# Altium schematic sheet Sheet2.SchDoc
size B; SheetNumber: 1; SheetTotal: 1; SPICEModelCacheWPHGAQRQ: <root> / <DocumentId>WPHGAQRQ</DocumentId> / <CacheFrame Number="0"> / <Model Name="diode" Kind="MDL"> / <Text>*Default Diode / *Diode Pinout: A,K / .MODEL DIODE D()</Text> / </Model> / </CacheFrame> / </root>
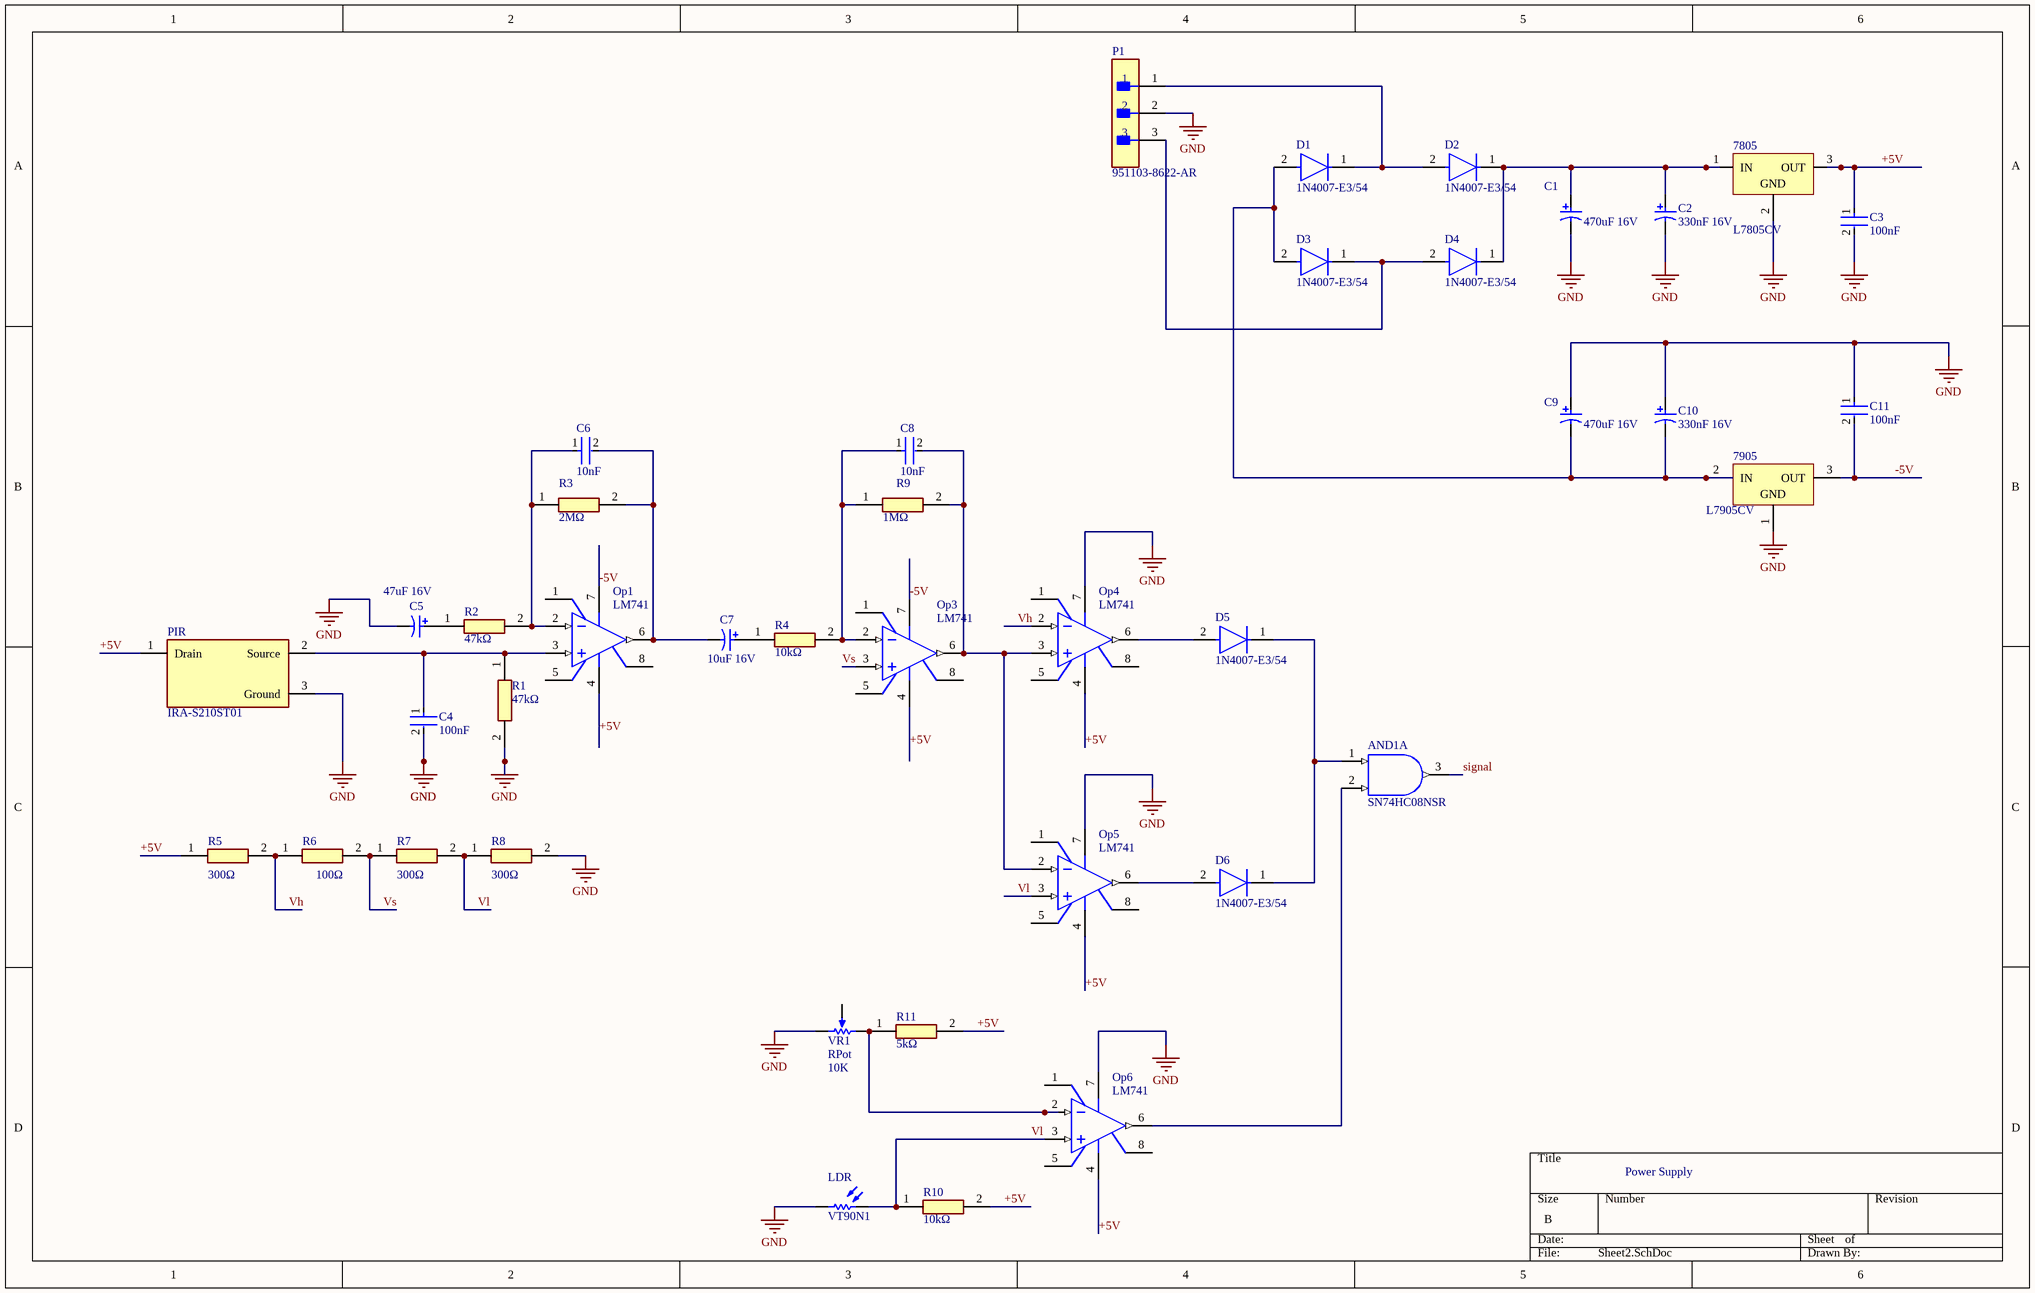
[diagram p0: Sheet2.SchDoc]

## Parts
7805  L7805CV  [TO220]
7905  L7905CV  [TO-220]
AND1  SN74HC08NSR  [NS0014A_M]  (part A of 5)
C1  470uF 16V  [CAPPR65-350-1150X800X1250]
C2  330nF 16V  [CAPPR65-350-1150X800X1250]
C3  100nF  [FP-K15H5-MFG]
C4  100nF  [FP-K15H5-MFG]
C5  47uF 16V  [CAPPR65-350-1150X800X1250]
C6  10nF  [FP-K15H5-MFG]
C7  10uF 16V  [CAPPR65-350-1150X800X1250]
C8  10nF  [FP-K15H5-MFG]
C9  470uF 16V  [CAPPR65-350-1150X800X1250]
C10  330nF 16V  [CAPPR65-350-1150X800X1250]
C11  100nF  [FP-K15H5-MFG]
D1  1N4007-E3/54  [FP-1N4007-MFG]
D2  1N4007-E3/54  [FP-1N4007-MFG]
D3  1N4007-E3/54  [FP-1N4007-MFG]
D4  1N4007-E3/54  [FP-1N4007-MFG]
D5  1N4007-E3/54  [FP-1N4007-MFG]
D6  1N4007-E3/54  [FP-1N4007-MFG]
LDR  VT90N1  [EXCE-VT90N1]
Op1  LM741  [P0008A]
Op3  LM741  [P0008A]
Op4  LM741  [P0008A]
Op5  LM741  [P0008A]
Op6  LM741  [P0008A]
P1  951103-8622-AR  [FP-951103-8622-AR-MFG]
PIR  IRA-S210ST01  [FP-IRA-S210ST01-MFG]
R1  47kΩ  [RESAD1650W60L650D250]
R2  47kΩ  [RESAD1650W60L650D250]
R3  2MΩ  [RESAD1650W60L650D250]
R4  10kΩ  [RESAD1650W60L650D250]
R5  300Ω  [RESAD1650W60L650D250]
R6  100Ω  [RESAD1650W60L650D250]
R7  300Ω  [RESAD1650W60L650D250]
R8  300Ω  [RESAD1650W60L650D250]
R9  1MΩ  [RESAD1650W60L650D250]
R10  10kΩ  [RESAD1650W60L650D250]
R11  5kΩ  [RESAD1650W60L650D250]
VR1  RPot  value 10K  [VR5]

## Nets
GND: 7805.2(GND) 7905.1(GND) C1.2 C2.2 C3.2 C4.2 C5.2 C9.1 C10.1 C11.1 LDR.1 Op4.7(V+) Op5.7(V+) Op6.7(V+) P1.2 PIR.3(Ground) R1.2 R8.2 VR1.2(BOT)
+5V: 7805.3(OUT) C3.1 Op1.4(V-) Op3.4(V-) Op4.4(V-) Op5.4(V-) Op6.4(V-) PIR.1(Drain) R5.1 R10.2 R11.2
-5V: 7905.3(OUT) C11.2 Op1.7(V+) Op3.7(V+)
signal: AND1.3(1Y)
Vh: Op4.2(IN-) R5.2 R6.1
Vl: LDR.2 Op5.3(IN+) Op6.3(IN+) R7.2 R8.1 R10.1
Vs: Op3.3(IN+) R6.2 R7.1
Net7805_1: 7805.1(IN) C1.1 C2.1 D2.1(C) D4.1(C)
Net7905_2: 7905.2(IN) C9.2 C10.2 D1.2(A) D3.2(A)
NetAND1_1: AND1.1(1A) D5.1(C) D6.1(C)
NetAND1_2: AND1.2(1B) Op6.6(OUT)
NetC4_1: C4.1 Op1.3(IN+) PIR.2(Source) R1.1
NetC5_1: C5.1 R2.1
NetC6_1: C6.1 Op1.2(IN-) R2.2 R3.1
NetC6_2: C6.2 C7.2 Op1.6(OUT) R3.2
NetC7_1: C7.1 R4.1
NetC8_1: C8.1 Op3.2(IN-) R4.2 R9.1
NetC8_2: C8.2 Op3.6(OUT) Op4.3(IN+) Op5.2(IN-) R9.2
NetD1_1: D1.1(C) D2.2(A) P1.1
NetD3_1: D3.1(C) D4.2(A) P1.3
NetD5_2: D5.2(A) Op4.6(OUT)
NetD6_2: D6.2(A) Op5.6(OUT)
NetOp6_2: Op6.2(IN-) R11.1 VR1.1(TOP)

Not connected (* = marked no-connect by the designer): Op1 1(OFS_NULL) 5(OFS_NULL) 8(NC); Op3 1(OFS_NULL) 5(OFS_NULL) 8(NC); Op4 1(OFS_NULL) 5(OFS_NULL) 8(NC); Op5 1(OFS_NULL) 5(OFS_NULL) 8(NC); Op6 1(OFS_NULL) 5(OFS_NULL) 8(NC); VR1 3(TAP)

## Notes on the sheet
- Power Supply

## Library data of the parts
7805 = CMP-0244-00483-1: Positive Voltage Regulator, 5V, 3-Pin TO-220; PackageDescription: TO, Thru-Hole, Vertical, Heatsink Mounted; 3 In-Line Leads; Pitch 2.54 mm; ComponentLink2Description: Datasheet; PackageReference: TO220; ComponentLink3URL: http://www.st.com/internet/com/TECHNICAL_RESOURCES/TECHNICAL_LITERATURE/PACKAGE_INFORMATION/CD00004649.pdf; DatasheetVersion: 16/11/2011; ComponentLink1Description: Manufacturer URL; ComponentLink1URL: http://www.st.com; PackageVersion: ver3.0; ComponentLink3Description: Package Specification; ComponentLink2URL: http://www.st.com/internet/com/TECHNICAL_RESOURCES/TECHNICAL_LITERATURE/DATASHEET/CD00000444.pdf
7905 = CMP-0244-00447-1: Negative Voltage Regulator, -5V, 3-Pin TO-220; ComponentLink2Description: Datasheet; DatasheetVersion: 1/11/2011; ComponentLink2URL: http://www.st.com/internet/com/TECHNICAL_RESOURCES/TECHNICAL_LITERATURE/DATASHEET/CD00000450.pdf; ComponentLink1Description: Manufacturer URL; PackageDescription: TO, Thru-Hole, Vertical, Heatsink Mounted; 3 In-Line Leads; Pitch 2.54 mm; ComponentLink1URL: http://www.st.com; PackageReference: TO-220; PackageVersion: 2011
AND1 = CMP-0777-00307-4: Quadruple 2-Input Positive-AND Gates, NS0014A, LARGE T&R; Manufacturer: Texas Instruments; Technology Family: HC; Schmitt Trigger: No; ICC @ Nom Voltage(Max)(mA): 0.02; Rating: Catalog; Bits(#): 4; Output Type: CMOS; VCC(Max)(V): 6; VCC(Min)(V): 2; tpd @ Nom Voltage(Max)(ns): 28; Voltage(Nom)(V): 5; F @ Nom Voltage(Max)(Mhz): 70; Generic Part Number: SN74HC08; PackageReference: NS0014A; DatasheetVersion: SCLS081F; Input Type: CMOS; Operating Temperature Range(C): -40 to 85
C1 C2 C5 C7 C9 C10 = CMP-1665-00042-2: Aluminum Electrolytic Capacitor, 100 uF, +/- 20%, 50 V, -40 to 85 degC, 2-Pin THD, RoHS, Bulk; Manufacturer: Panasonic; Lead Diameter: 0.6mm; Dielectric Material: Aluminium; Voltage Rating (DC): 50V; Ripple Current (AC): 250mA; Polarity: Polar; Leakage Current: 3uA; Capacitance: 100uF; Life (Hours): 2000Hour; Lead/Base Style: Straight; Dissipation Factor: 0.12%; Radiation Hardening: No; Height: 11.5mm; Package Quantity: 200; Package Reference: CAPPR65-350-1150X800X1250; Min Operating Temperature: -40degC; Mount: ThroughHole; Package Description: 2-Pin Radial Lead, Dia 8 mm, Height 12.5 mm; Case/Package: Radial; Diameter: 8mm; Voltage Rating: 50V; Length: 11.5mm; REACH SVHC: NoSVHC; Height - Seated (Max): 0.492inch; Datasheet URL: https://industrial.panasonic.com/cdbs/www-data/pdf/RDF0000/ABA0000C1218.pdf; RoHSCompliant: true; Ripple Current: 250mA; Lead Free: LeadFree; Voltage: 50V; Manufacturer URL: http://www.panasonic.com/; Number of Pins: 2; Datasheet Version: Rev. 05, 10/2016; Packaging: Bulk; Termination: Radial; Max Operating Temperature: 85degC; Tolerance: 20%; Lead Pitch: 3.5mm
C3 C4 C11 = CMP-02417-000048-1: CAP CER 0.1UF 50V X7R RADIAL; Tolerance: 10%; Lead/Base Style: Formed Leads; Lead Length: 30mm; Lead Diameter: 0.5mm; Radiation Hardening: No; Capacitance: 100nF; Lead Pitch: 5mm; Voltage: 50V; Mount: Through Hole; Package Quantity: 5000; Series: K; Case/Package: Dipped; Min Operating Temperature: -55°C; Depth: 2.5mm; Height - Seated (Max): 0.1inch; Voltage Rating (DC): 50V; Packaging: Bulk; RoHS Compliant: Yes; Construction: RADIAL; Thickness: 2.6mm; Max Operating Temperature: 125°C; Voltage Rating: 50V; Diameter: 500um; Dielectric: X7R; Width: 2.5mm; Length: 4mm; Weight: 0.005644oz; Termination: Radial; Height: 4mm
C6 C8 = CMP-02417-000048-1: CAP CER 0.1UF 50V X7R RADIAL; Capacitance: 100nF; Tolerance: 10%; Lead/Base Style: Formed Leads; Lead Length: 30mm; Lead Diameter: 0.5mm; Radiation Hardening: No; Lead Pitch: 5mm; Voltage: 50V; Mount: Through Hole; Package Quantity: 5000; Series: K; Case/Package: Dipped; Min Operating Temperature: -55°C; Depth: 2.5mm; Height - Seated (Max): 0.1inch; Voltage Rating (DC): 50V; Packaging: Bulk; RoHS Compliant: Yes; Construction: RADIAL; Thickness: 2.6mm; Max Operating Temperature: 125°C; Voltage Rating: 50V; Diameter: 500um; Dielectric: X7R; Width: 2.5mm; Length: 4mm; Weight: 0.005644oz; Termination: Radial; Height: 4mm
D1-D6 = CMP-02540-000046-1: DIODE GEN PURP 1KV 1A DO204AL; Manufacturer: Vishay; Value: 15pF; Max Junction Temp: +150°C; Max Surge Forward Current: 30A; Max Repetitive Reverse Voltage: 1000V; Peak Reverse Current: 30uA; Octopart: https://octopart.com/1n4007-e3%2F54-vishay-39548207; Digikey Description: DIODE GEN PURP 1KV 1A DO204AL; Category: Diode; Mouser Description: Rectifiers Vr/1000V Io/1A; Automotive: No; Package: 1N4007; Device Class L3: Rectifier Diodes; Temperature Range High: +150°C; Capacitance: 15pF; Ipc Land Pattern Name: DIOPA1088W105L520D270; Lead Free: Yes; ComponentLink2Description: Datasheet; Forward Current: 1A; Device Class L1: Discrete Semiconductors; ComponentLink2URL: http://www.vishay.com/docs/88503/1n4001.pdf; Temperature Range Low: -50°C; Height: 2.7mm; RoHS: TRUE; Temperature: -50°C to +150°C; Device Class L2: Diodes; Manufacturer Part Number: 1N4007-E3/54
LDR = CMP-2000-07406-1: Photoconductive Resistor, 200 kOhm, 100 V, 80 mW, -40 to 75 degC, 2-Pin THD, RoHS; Manufacturer: Excelitas Technology; SVHC: Cadmiumchloride(15-Jun-2015); Power Rating: 80mW; Resistance @ Lux: 12kohm; Voltage Rating: 100V; Product Range: -; Datasheet Version: 09/2006; Resistor Case Style: -; Operating Temperature Max: 75°C; Package Reference: VT90N1; Datasheet URL: http://datasheet.octopart.com/VT90N1-Excelitas-datasheet-10388451.pdf; Mounting Technology: ThroughHole; Operating Temperature Min: -40°C; Dark Resistance: 200kohm; Package Description: 2-Pin Through Hole Device, Body Width 4.17 mm (Max), Height 2.29 mm; Manufacturer URL: http://www.excelitas.com/Pages/Index.aspx; Packaging: Each
Op1 Op3-Op6 = CMP-0055-00162-3: Operational Amplifier, 8-pin MDIP, Pb-Free; Manufacturer: Texas Instruments; PackageTopMarking: NSUZXYTTE#*LM*741CN; PowerWise: N; CompType: Amplifiers; ComponentLink1Description: Datasheet URL; ComponentLink1URL: http://www.ti.com/general/docs/lit/getliterature.tsp?genericPartNumber=LM741&fileType=pdf; PackageDescription: MDIP, .365 x .250 x .130in, 8 Lead, .100in Pitch; RoHS: Y; PinCount: 8; Code_JEDEC: MS-001-BA; Package Reference: P0008A
P1 = CMP-05379-000003-1: CONN HEADER VERT 3POS 2MM; Manufacturer: 3M; Conn Gender: Male; Current Rating: 2A; Number Of Contacts: 3; Conn Orientation: Straight; Digikey Description: CONN HEADER VERT 3POS 2MM; Device Class L3: unset; Category: Conn; Height: 6.3mm; Manufacturer Part Number: 951103-8622-AR; RoHS: TRUE; Contact Material: Gold,Nickel; ComponentLink2Description: Datasheet; Temperature Range Low: -55°C; Device Class L1: Connectors; Pitch: 2mm; Mouser Description: Header; PinStrip; CopperAlloy; HighTempThermoplastic; 3Cnts; 1A; RtAngle; 951Series; Octopart: https://octopart.com/951103-8622-ar-3m-14400669; Package: 951103-8622-AR; Lead Free: Yes; Device Class L2: Headers and Wire Housings; Temperature Range High: +125°C; ComponentLink2URL: http://multimedia.3m.com/mws/media/1400506O/3m-pin-strip-header-951-series-78-5100-2653-3.pdf; Automotive: No; Temperature: -55°C to +125°C; Number Of Rows: 1
PIR = CMP-06150-000001-1: MOTION SENSOR; Manufacturer: Murata; Min Supply Voltage: 2V; Max Supply Voltage: 15V; Device Class L3: Photoelectric Sensors; Package: IRA-S210ST01; Temperature Range Low: -40°C; Temperature Range High: +70°C; ComponentLink2Description: Datasheet; Category: IC; ComponentLink2URL: https://www.murata.com/en-us/api/pdfdownloadapi?cate=luInfraredSensors&partno=IRA-S210ST01; Digikey Description: MOTION SENSOR; Manufacturer Part Number: IRA-S210ST01; Octopart: https://octopart.com/ira-s210st01-murata-30987376; Temperature: -40°C to +70°C; Lead Free: Yes; Automotive: No; RoHS: TRUE; Device Class L1: Sensors; Height: 4.9mm; Device Class L2: Optical Sensors
R1-R11 = MRS25000C1002FC100: Resistor; Manufacturer_Name: Vishay; Datasheet Link: http://www.vishay.com/docs/28724/mrs16m25.pdf; Manufacturer_Part_Number: MRS25000C1002FC100; Mouser Part Number: 594-2322-156-11003; Mouser Price/Stock: https://www.mouser.co.uk/ProductDetail/Vishay-BC-Components/MRS25000C1002FC100?qs=B52Dqq1Chl6h6M7hjffcZQ%3D%3D; Arrow Part Number: MRS25000C1002FC100; Arrow Price/Stock: https://www.arrow.com/en/products/mrs25000c1002fc100/vishay
VR1 = RPot: Potentiometer; Sim Note: Enter the Resistance value and the set point into parameter fields.; Set Position: 0.5; Published: 8-Jun-2000; LatestRevisionDate: 17-Jul-2002; LatestRevisionNote: Re-released for DXP Platform.; PackageReference: VR5; Publisher: Altium Limited; PackageDescription: Variable Resistor, Thru-Hole; 3 Leads